# Altium schematic sheet 005_DP.SchDoc: =title_line_1 + title_line_2
size 891 x 420 mm; SheetNumber: 5
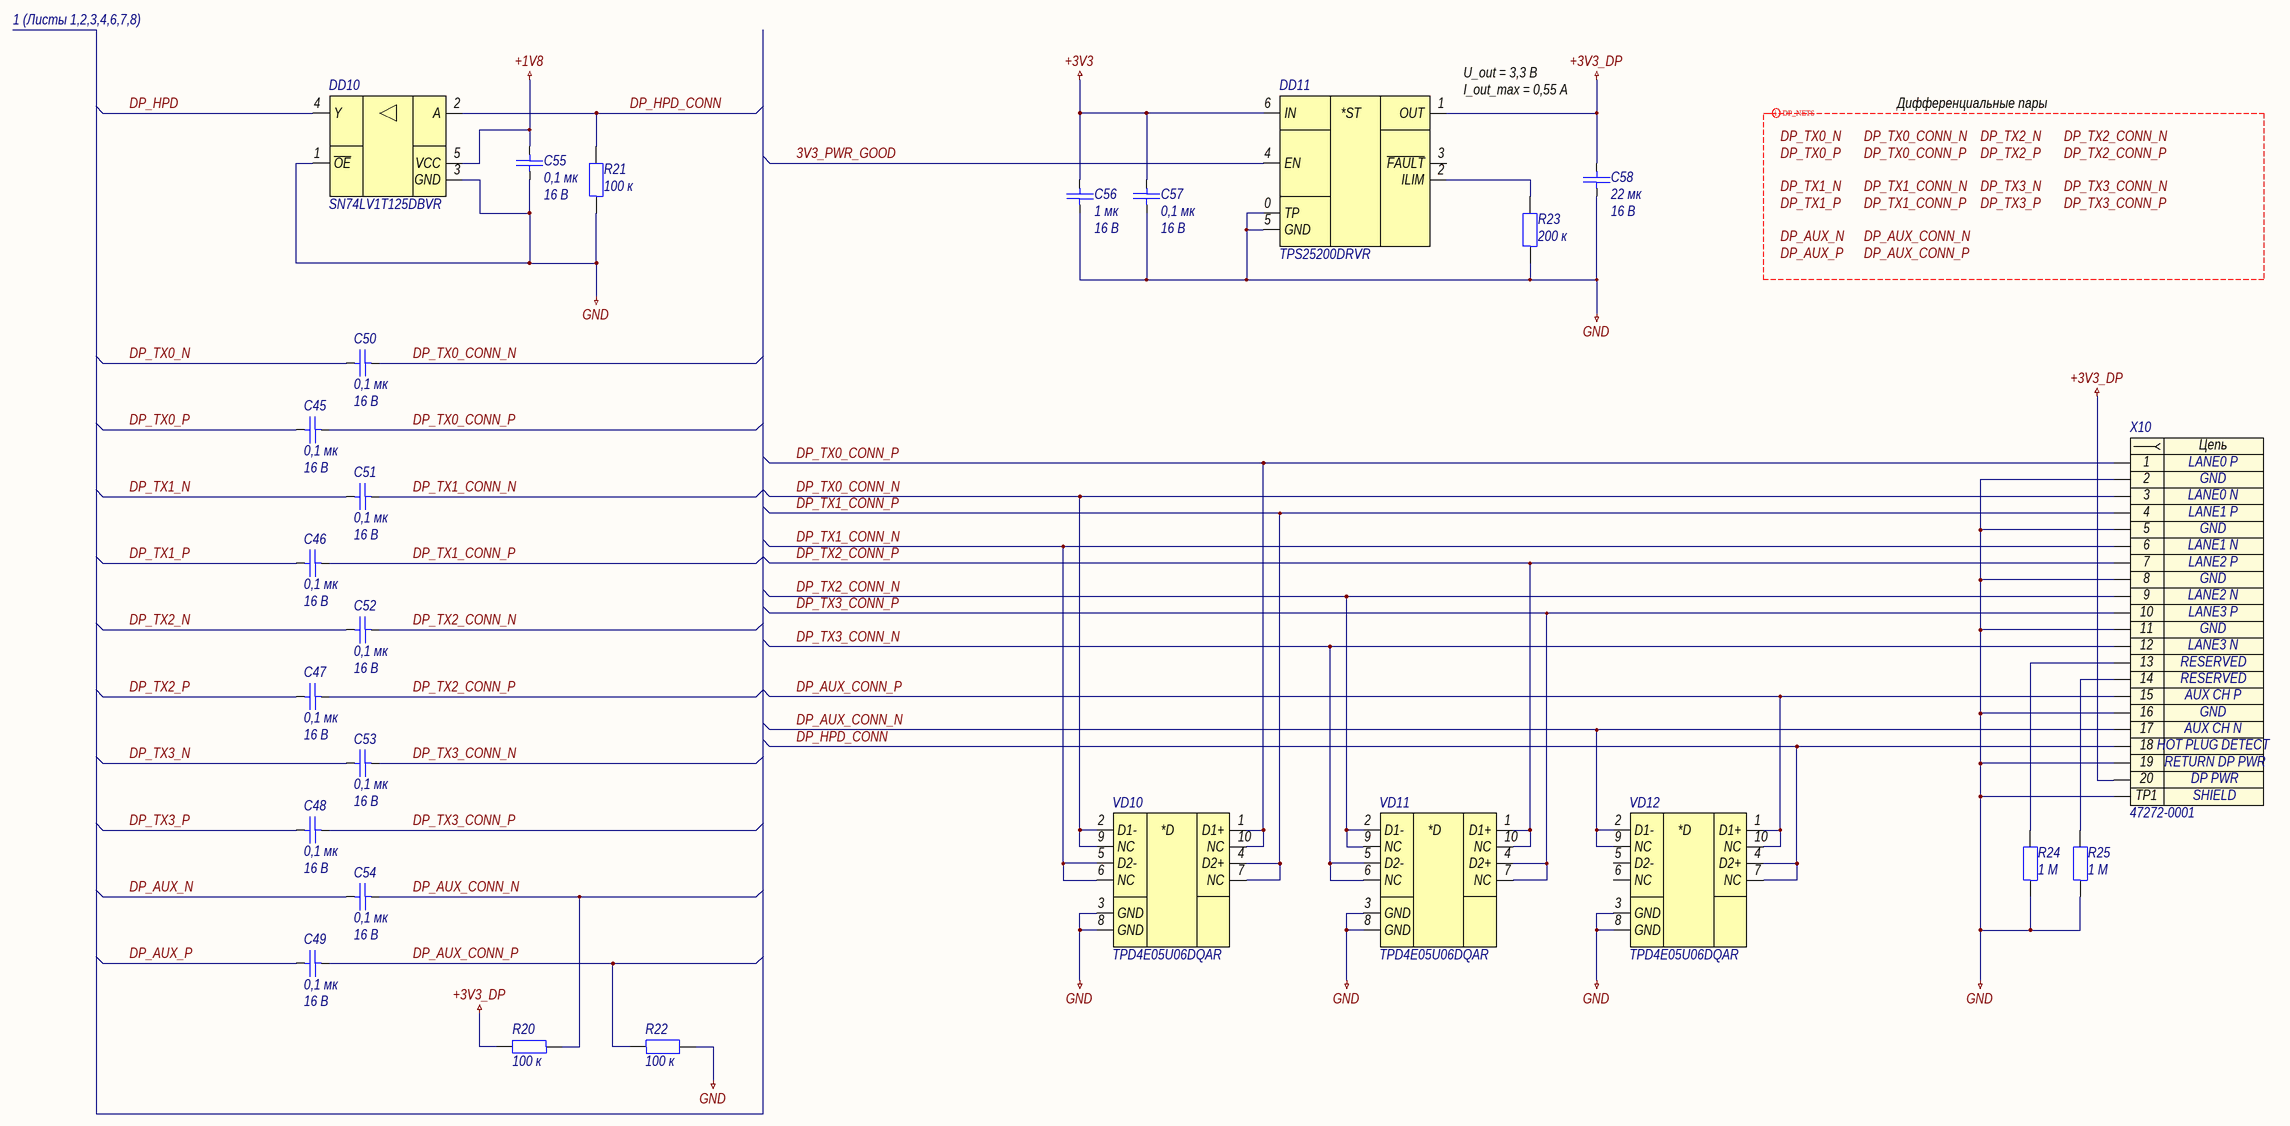
[diagram p0: 005_DP.SchDoc]

## Parts
C45  0,1 мк  Напряжение: 16 В  [C0603]
C46  0,1 мк  Напряжение: 16 В  [C0603]
C47  0,1 мк  Напряжение: 16 В  [C0603]
C48  0,1 мк  Напряжение: 16 В  [C0603]
C49  0,1 мк  Напряжение: 16 В  [C0603]
C50  0,1 мк  Напряжение: 16 В  [C0603]
C51  0,1 мк  Напряжение: 16 В  [C0603]
C52  0,1 мк  Напряжение: 16 В  [C0603]
C53  0,1 мк  Напряжение: 16 В  [C0603]
C54  0,1 мк  Напряжение: 16 В  [C0603]
C55  0,1 мк  Напряжение: 16 В  [C0603]
C56  1 мк  Напряжение: 16 В  [C0603]
C57  0,1 мк  Напряжение: 16 В  [C0603]
C58  22 мк  Напряжение: 16 В  [C0805]
DD10  SN74LV1T125DBVR  [SOT-23-5-P95-290X280X145]
DD11  TPS25200DRVR  [WSON-6-P65-200X200X80-L30X25-T170X110]
R20  100 к  [R0603]
R21  100 к  [R0603]
R22  100 к  [R0603]
R23  200 к  [R0603]
R24  1 М  [R0603]
R25  1 М  [R0603]
VD10  TPD4E05U06DQAR  [USON-10-P50-250X100X55-L36X20]
VD11  TPD4E05U06DQAR  [USON-10-P50-250X100X55-L36X20]
VD12  TPD4E05U06DQAR  [USON-10-P50-250X100X55-L36X20]
X10  47272-0001  [47272-0001]

## Nets
+1V8: C55.2 DD10.5(VCC)
+3V3: C56.1 C57.2 DD11.6(IN)
+3V3_DP: C58.1 DD11.1(OUT) R20.2 X10.20
GND: C55.1 C56.2 C57.1 C58.2 DD10.1(~{OE}) DD10.3(GND) DD11.0(TP) DD11.5(GND) R21.1 R22.2 R23.1 R24.1 R25.1 VD10.3(GND) VD10.8(GND) VD11.3(GND) VD11.8(GND) VD12.3(GND) VD12.8(GND) X10.2 X10.5 X10.8 X10.11 X10.16 X10.19 X10.TP1
3V3_PWR_GOOD: DD11.4(EN)
DP_AUX_CONN_N: C54.2 R20.1 VD12.2(D1-) VD12.9(NC) X10.17
DP_AUX_CONN_P: C49.2 R22.1 VD12.1(D1+) VD12.10(NC) X10.15
DP_AUX_N: C54.1
DP_AUX_P: C49.1
DP_HPD: DD10.4(Y)
DP_HPD_CONN: DD10.2(A) R21.2 VD12.4(D2+) VD12.7(NC) X10.18
DP_TX0_CONN_N: C50.2 VD10.2(D1-) VD10.9(NC) X10.3
DP_TX0_CONN_P: C45.2 VD10.1(D1+) VD10.10(NC) X10.1
DP_TX0_N: C50.1
DP_TX0_P: C45.1
DP_TX1_CONN_N: C51.2 VD10.5(D2-) VD10.6(NC) X10.6
DP_TX1_CONN_P: C46.2 VD10.4(D2+) VD10.7(NC) X10.4
DP_TX1_N: C51.1
DP_TX1_P: C46.1
DP_TX2_CONN_N: C52.2 VD11.2(D1-) VD11.9(NC) X10.9
DP_TX2_CONN_P: C47.2 VD11.1(D1+) VD11.10(NC) X10.7
DP_TX2_N: C52.1
DP_TX2_P: C47.1
DP_TX3_CONN_N: C53.2 VD11.5(D2-) VD11.6(NC) X10.12
DP_TX3_CONN_P: C48.2 VD11.4(D2+) VD11.7(NC) X10.10
DP_TX3_N: C53.1
DP_TX3_P: C48.1
NetDD11_2: DD11.2(ILIM) R23.2
NetR24_2: R24.2 X10.13
NetR25_2: R25.2 X10.14

Not connected (* = marked no-connect by the designer): DD11 3(~{FAULT}); VD12 5(D2-) 6(NC)

## Layout directives
differential pair; rule Differential Pairs Routing [Pref Gap = 0.3mm    Min Gap  = 0.15mm    Max Gap  = 0.3mmPref Width = 0.126mm    Min Width  = 0.126mm    Max Width  = 0.155mm]; differential pair class DP_SIGNALS: DP_AUX_CONN_N, DP_AUX_CONN_P, DP_AUX_N, DP_AUX_P, DP_TX0_CONN_N, DP_TX0_CONN_P, DP_TX0_N, DP_TX0_P, DP_TX1_CONN_N, DP_TX1_CONN_P, DP_TX1_N, DP_TX1_P, DP_TX2_CONN_N, DP_TX2_CONN_P, DP_TX2_N, DP_TX2_P, DP_TX3_CONN_N, DP_TX3_CONN_P, DP_TX3_N, DP_TX3_P

## Notes on the sheet
- 1 (Листы 1,2,3,4,6,7,8)
- U_out = 3,3 В
  I_out_max = 0,55 А
- Дифференциальные пары
- Labels drawn without touching a wire or pin: DP_AUX_CONN_N, DP_AUX_CONN_P, DP_AUX_N, DP_AUX_P, DP_TX0_CONN_N, DP_TX0_CONN_P, DP_TX0_N, DP_TX0_P, DP_TX1_CONN_N, DP_TX1_CONN_P, DP_TX1_N, DP_TX1_P, DP_TX2_CONN_N, DP_TX2_CONN_P, DP_TX2_N, DP_TX2_P, DP_TX3_CONN_N, DP_TX3_CONN_P, DP_TX3_N, DP_TX3_P
- Подп. и дата
- Инв. № дубл.
- Взам. инв. №
- Инв. № подл.
- Лист
- Изм.
- № докум.
- Подп.
- Дата
- Копировал
- Формат
- А3х3
- (in symbol dd0002) *ST
- (in symbol vd0017) *D
- (in symbol x0053) Цепь

## Library data of the parts
C45-C55 C57 = c0081: =Описание; ID: c0081; Фамилия: Паньков; Описание: Конденсатор керамический чип 0603 100 нФ 16 В ±10 %; Наименование: CC0603KRX7R7BB104; Производитель: YAGEO Corp.; Отклонение: ±10 %; Рабочие температуры: от –55 °С до +125 °С; Температурный коэффициент емкости: X7R; Корпус: 0603; Номинал: 0,1 мк; Номинальное напряжение: 16 В; HelpURL: https://www.yageo.com/upload/media/product/productsearch/datasheet/mlcc/UPY-GPHC_X7R_6.3V-to-50V_20.pdf
C56 = c0113: =Описание; ID: c0113; Фамилия: Паньков; Описание: Конденсатор керамический чип 0603 1 мкФ 16 В ±10 %; Наименование: CC0603KRX7R7BB105; Производитель: YAGEO Corp.; Отклонение: ±10 %; Рабочие температуры: от –55 °С до +125 °С; Температурный коэффициент емкости: X7R; Корпус: 0603; Номинал: 1 мк; Номинальное напряжение: 16 В; HelpURL: https://www.yageo.com/upload/media/product/productsearch/datasheet/mlcc/UPY-GPHC_X7R_6.3V-to-50V_20.pdf
C58 = c0159: =Описание; ID: c0159; Фамилия: Паньков; Описание: Конденсатор керамический чип 0805 22 мкФ 16 В ±20 %; Наименование: CC0805MRX5R7BB226; Производитель: YAGEO Corp.; Отклонение: ±20 %; Рабочие температуры: от –55 °С до +85 °С; Температурный коэффициент емкости: X5R; Корпус: 0805; Номинал: 22 мк; Номинальное напряжение: 16 В; HelpURL: https://www.yageo.com/upload/media/product/productsearch/datasheet/mlcc/UPY-GPHC_X5R_4V-to-50V_26.pdf
DD10 = dd0003: =Описание; ID: dd0003; Фамилия: Ларионов; Описание: Буферная микросхема 1 линия 3 состояния выхода; Производитель: Texas Instruments Inc.; Корпус: SOT-23-5; Наименование: SN74LV1T125DBVR; HelpURL: https://www.ti.com/product/SN74LV1T125
DD11 = dd0002: =Описание; ID: dd0002; Фамилия: Ларионов; Описание: Защитная микросхема eFuse 6,5 В и 2,9 А; Производитель: Texas Instruments Inc.; Напряжение: от 2,5 В до 6,5 В; Максимальное напряжение: 20 В; Ток: от 0,085 А до 2,9 А; Рабочие температуры: от –40 °С до +125 °С; Корпус: WSON-6; Наименование: TPS25200DRVR; HelpURL: https://www.ti.com/product/TPS25200
R20-R22 = r0141: =Описание; ID: r0141; Фамилия: Водорезов; Описание: Резистор чип 0603 100 кОм ±1 % 0,1 Вт; Наименование: RC0603FR-07100KL; Производитель: YAGEO Corp.; Отклонение: ±1 %; Номинальное напряжение: 75 В; Номинальный ток: 1 А; Рабочие температуры: от –55 °С до +155 °С; Корпус: 0603; Примечание: Ряд E24; Номинал: 100 к; HelpURL: https://www.yageo.com/upload/media/product/productsearch/datasheet/rchip/PYu-RC_Group_51_RoHS_L_11.pdf
R23 = r0153: =Описание; ID: r0153; Фамилия: Паньков; Описание: Резистор чип 0603 200 кОм ±1 % 0,1 Вт; Наименование: RC0603FR-07200KL; Производитель: YAGEO Corp.; Отклонение: ±1 %; Номинальное напряжение: 75 В; Номинальный ток: 1 А; Рабочие температуры: от –55 °С до +155 °С; Корпус: 0603; Примечание: Ряд E24; Номинал: 200 к; HelpURL: https://www.yageo.com/upload/media/product/productsearch/datasheet/rchip/PYu-RC_Group_51_RoHS_L_11.pdf
R24 R25 = r0173: =Описание; ID: r0173; Фамилия: Ляпцев; Описание: Резистор чип 0603 1 МОм ±1 % 0,1 Вт; Наименование: RC0603FR-071ML; Производитель: YAGEO Corp.; Отклонение: ±1 %; Номинальное напряжение: 75 В; Номинальный ток: 1 А; Рабочие температуры: от –55 °С до +155 °С; Корпус: 0603; Примечание: Ряд E24; Номинал: 1 М; HelpURL: https://www.yageo.com/upload/media/product/productsearch/datasheet/rchip/PYu-RC_Group_51_RoHS_L_11.pdf
VD10-VD12 = vd0017: =Описание; ID: vd0017; Фамилия: Ларионов; Описание: Диодная сборка для подавления помех 5,5 В; Производитель: Texas Instruments Inc.; Корпус: USON-10; Наименование: TPD4E05U06DQAR; HelpURL: https://www.ti.com/product/TPD4E05U06
X10 = x0053: =Описание; Contact_1: LANE0 P; Contact_2: GND; Contact_3: LANE0 N; Contact_4: LANE1 P; Contact_6: LANE1 N; Contact_7: LANE2 P; Contact_9: LANE2 N; Contact_10: LANE3 P; Contact_12: LANE3 N; Contact_13: RESERVED; Contact_15: AUX CH P; Contact_17: AUX CH N; Contact_18: HOT PLUG DETECT; Contact_19: RETURN DP PWR; TP1: SHIELD; Contact_20: DP PWR; ID: x0053; Фамилия: Ларионов; Описание: DisplayPort гнездо угловой; Производитель: Molex; Contact_5: GND; Contact_8: GND; Contact_11: GND; Contact_14: RESERVED; Contact_16: GND; Наименование: 47272-0001; HelpURL: https://www.molex.com/molex/products/part-detail/io_connectors/0472720001